# Altium schematic sheet PandMshem.SchDoc
size A; SheetNumber: 1; SheetTotal: 3
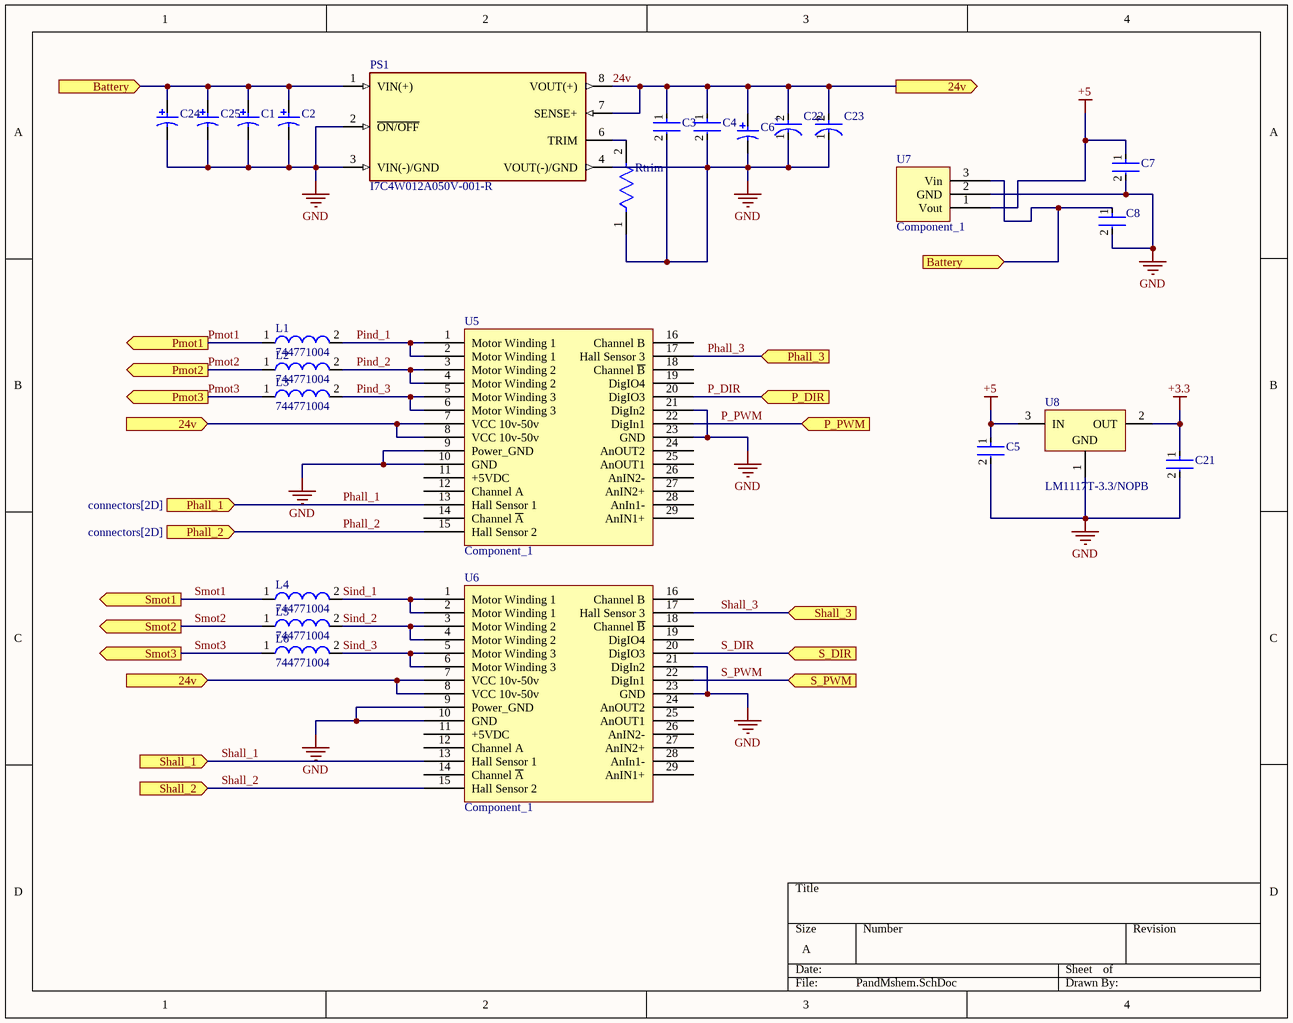
[diagram p0: PandMshem.SchDoc]

## Parts
C1  ECA1HM101  [CAPPR65-350-1150X800X1250]  (value not drawn)
C2  ECA1HM220  [CAPPR55-200-1100X500X1200]  (value not drawn)
C3  08055C105KAT2A  [FP-0805-L_2_01_0_2-W_1_25-MFG]  (value not drawn)
C4  C3225X7S1H106M250AB  [FP-C3225-250-0_4-IPC_C]  (value not drawn)
C5  C3225X7S1H106M250AB  [FP-C3225-250-0_4-IPC_C]  (value not drawn)
C6  ECA1HM101  [CAPPR65-350-1150X800X1250]  (value not drawn)
C7  GRM21BR61E226ME44L  [FP-GRM21B-0_2-e0_2_0_7-IPC_B]  (value not drawn)
C8  C3225X7S1H106M250AB  [FP-C3225-250-0_4-IPC_C]  (value not drawn)
C21  GRM21BR61E226ME44L  [FP-GRM21B-0_2-e0_2_0_7-IPC_B]  (value not drawn)
C22  EEUFM1V331B  [FP-RAD-TH-D_10_0_5-L_16_1-MFG]  (value not drawn)
C23  EEUFM1V331B  [FP-RAD-TH-D_10_0_5-L_16_1-MFG]  (value not drawn)
C24  ECA1HM101  [CAPPR65-350-1150X800X1250]  (value not drawn)
C25  ECA1HM101  [CAPPR65-350-1150X800X1250]  (value not drawn)
L1  744771004  [WE-PD-L]
L2  744771004  [WE-PD-L]
L3  744771004  [WE-PD-L]
L4  744771004  [WE-PD-L]
L5  744771004  [WE-PD-L]
L6  744771004  [WE-PD-L]
PS1  I7C4W012A050V-001-R  [CONV_I7C4W012A050V-001-R]
Rtrim  CRCW0805560KFKEA  [FP-CRCW0805-e3-IPC_A]  (value not drawn)
U5  Component_1  [Motor_Driver]
U6  Component_1  [Motor_Driver]
U7  Component_1  [5v_supply]
U8  LM1117T-3.3/NOPB  [NDE0003A]

## Ports
24v (in, see connectors[2B], connectors[2C], PandMshem[1B], PandMshem[3A]), 24v (in, see connectors[2B], connectors[2C], PandMshem[1C], PandMshem[3A]), 24v (out, see connectors[2B], connectors[2C], PandMshem[1B], PandMshem[1C]), Battery (in, see connectors[2B], connectors[3A], PandMshem[1A], Solenoid_drivers[1B], Solenoid_drivers[1C], Solenoid_drivers[1D], Solenoid_drivers[2A]), Battery (in, see connectors[2B], connectors[3A], PandMshem[3B], Solenoid_drivers[1B], Solenoid_drivers[1C], Solenoid_drivers[1D], Solenoid_drivers[2A]), P_DIR (in, see connectors[2A]), P_PWM (in, see connectors[2A]), Phall_1 (in, see connectors[2D]), Phall_2 (in, see connectors[2D]), Phall_3 (in, see connectors[2D]), Pmot1 (out, see connectors[4A]), Pmot2 (out, see connectors[4A]), Pmot3 (out, see connectors[3B]), S_DIR (in, see connectors[3A]), S_PWM (in, see connectors[3A]), Shall_1 (in, see connectors[3C]), Shall_2 (in, see connectors[3D]), Shall_3 (in, see connectors[3D]), Smot1 (out, see connectors[4B]), Smot2 (out, see connectors[3B]), Smot3 (out, see connectors[4C])

## Nets
+3.3: C21.1 U8.2(OUT)
+5: C5.1 C7.1 U7.1(Vout) U8.3(IN)
GND: C1.2 C2.2 C3.2 C4.2 C5.2 C6.2 C7.2 C8.2 C21.2 C22.1(C) C23.1(C) C24.2 C25.2 PS1.2(~{ON/OFF}) PS1.3(VIN(-)/GND) PS1.4(VOUT(-)/GND) Rtrim.1 U5.9(Power_GND) U5.10(GND) U5.21(DigIn2) U5.23(GND) U6.9(Power_GND) U6.10(GND) U6.21(DigIn2) U6.23(GND) U7.2(GND) U8.1(GND)
24v: C3.1 C4.1 C6.1 C22.2(A) C23.2(A) PS1.7(SENSE+) PS1.8(VOUT(+)) U5.7(VCC_10v-50v) U5.8(VCC_10v-50v) U6.7(VCC_10v-50v) U6.8(VCC_10v-50v) ; port 24v
Battery: C1.1 C2.1 C8.1 C24.1 C25.1 PS1.1(VIN(+)) U7.3(Vin) ; port Battery
P_DIR: U5.20(DigIO3) ; port P_DIR
P_PWM: U5.22(DigIn1) ; port P_PWM
Phall_1: U5.13(Hall_Sensor_1) ; port Phall_1
Phall_2: U5.15(Hall_Sensor_2) ; port Phall_2
Phall_3: U5.17(Hall_Sensor_3) ; port Phall_3
Pind_1: L1.2 U5.1(Motor_Winding_1) U5.2(Motor_Winding_1)
Pind_2: L2.2 U5.3(Motor_Winding_2) U5.4(Motor_Winding_2)
Pind_3: L3.2 U5.5(Motor_Winding_3) U5.6(Motor_Winding_3)
Pmot1: L1.1 ; port Pmot1
Pmot2: L2.1 ; port Pmot2
Pmot3: L3.1 ; port Pmot3
S_DIR: U6.20(DigIO3) ; port S_DIR
S_PWM: U6.22(DigIn1) ; port S_PWM
Shall_1: U6.13(Hall_Sensor_1) ; port Shall_1
Shall_2: U6.15(Hall_Sensor_2) ; port Shall_2
Shall_3: U6.17(Hall_Sensor_3) ; port Shall_3
Sind_1: L4.2 U6.1(Motor_Winding_1) U6.2(Motor_Winding_1)
Sind_2: L5.2 U6.3(Motor_Winding_2) U6.4(Motor_Winding_2)
Sind_3: L6.2 U6.5(Motor_Winding_3) U6.6(Motor_Winding_3)
Smot1: L4.1 ; port Smot1
Smot2: L5.1 ; port Smot2
Smot3: L6.1 ; port Smot3
NetPS1_6: PS1.6(TRIM) Rtrim.2

Not connected (* = marked no-connect by the designer): U5 11(+5VDC) 12(Channel_A) 14(Channel_~{A}) 16(Channel_B) 18(Channel_~{B}) 19(DigIO4) 24(AnOUT2) 25(AnOUT1) 26(AnIN2-) 27(AnIN2+) 28(AnIn1-) 29(AnIN1+); U6 11(+5VDC) 12(Channel_A) 14(Channel_~{A}) 16(Channel_B) 18(Channel_~{B}) 19(DigIO4) 24(AnOUT2) 25(AnOUT1) 26(AnIN2-) 27(AnIN2+) 28(AnIn1-) 29(AnIN1+)

## Notes on the sheet
- (in symbol CMP-05427-002072-1) +

## Library data of the parts
C1 C6 C24 C25 = CMP-1665-00042-2: Aluminum Electrolytic Capacitor, 100 uF, +/- 20%, 50 V, -40 to 85 degC, 2-Pin THD, RoHS, Bulk; Manufacturer: Panasonic; Lead Diameter: 0.6mm; Dielectric Material: Aluminium; Voltage Rating (DC): 50V; Ripple Current (AC): 250mA; Polarity: Polar; Leakage Current: 3uA; Capacitance: 100uF; Life (Hours): 2000Hour; Lead/Base Style: Straight; Dissipation Factor: 0.12%; Radiation Hardening: No; Height: 11.5mm; Package Quantity: 200; Package Reference: CAPPR65-350-1150X800X1250; Min Operating Temperature: -40degC; Mount: ThroughHole; Package Description: 2-Pin Radial Lead, Dia 8 mm, Height 12.5 mm; Case/Package: Radial; Diameter: 8mm; Voltage Rating: 50V; Length: 11.5mm; REACH SVHC: NoSVHC; Height - Seated (Max): 0.492inch; Datasheet URL: https://industrial.panasonic.com/cdbs/www-data/pdf/RDF0000/ABA0000C1218.pdf; RoHSCompliant: true; Ripple Current: 250mA; Lead Free: LeadFree; Voltage: 50V; Manufacturer URL: http://www.panasonic.com/; Number of Pins: 2; Datasheet Version: Rev. 05, 10/2016; Packaging: Bulk; Termination: Radial; Max Operating Temperature: 85degC; Tolerance: 20%; Lead Pitch: 3.5mm
C2 = CMP-1665-00036-2: Aluminum Electrolytic Capacitor, 22 uF, +/- 20%, 50 V, -40 to 85 degC, 2-Pin THD, RoHS, Bulk; Manufacturer: Panasonic; Ripple Current: 100mA; Life (Hours): 2000Hour; Voltage: 50V; Dissipation Factor: 0.12%; Leakage Current: 3uA; Lead/Base Style: Straight; Capacitance: 22uF; Lead Diameter: 0.5mm; Max Operating Temperature: 85degC; Height: 11mm; Package Reference: CAPPR55-200-1100X500X1200; Radiation Hardening: No; RoHSCompliant: true; Termination: Radial; Case/Package: Radial; REACH SVHC: NoSVHC; Height - Seated (Max): 0.472inch; Min Operating Temperature: -40degC; Packaging: Bulk; Manufacturer URL: http://www.panasonic.com/; Length: 11mm; Tolerance: 20%; Voltage Rating: 50V; Voltage Rating (DC): 50V; Datasheet URL: https://industrial.panasonic.com/cdbs/www-data/pdf/RDF0000/ABA0000C1218.pdf; Lead Pitch: 2mm; Ripple Current (AC): 100mA; Package Description: 2-Pin Radial Lead, Dia 5 mm, Height 12 mm; Diameter: 5mm; Datasheet Version: Rev. 05, 10/2016; Package Quantity: 200; Mount: ThroughHole
C3 = CMP-2007-04696-2: General Purpose Ceramic Capacitor, 0805, 1uF, 10%, X7R, 15%, 50V; Dissipation Factor: 2.5%; Packaging: Tape and Reel; Lead Free: Lead Free; Contact Plating: Tin; Dielectric: X7R; Tolerance: 10%; Capacitance: 1uF; REACH SVHC: No SVHC; Voltage Rating (DC): 50V; Depth: 1.25mm; Voltage Rating: 50V; Radiation Hardening: No; Case Code (Metric): 2012; Width: 0.049inch; Package Quantity: 1; Mount: Surface Mount; Length: 2.01mm; Series: -; Thickness: 0.037inch; Max Operating Temperature: 125°C; RoHS Compliant: Yes; Termination: SMD/SMT; Case/Package: 0805; Min Operating Temperature: -55°C; Voltage: 50V; Case Code (Imperial): 0805
C4 C5 C8 = CMP-08246-003772-1: Multilayer Ceramic Capacitors 10uF ±20% 50V X7S SMD 1210; Package Quantity: 1; Depth: 2.5mm; Dielectric: X7S; Radiation Hardening: No; Max Operating Temperature: 125°C; REACH SVHC: No SVHC; Thickness: 0.11inch; Voltage Rating: 50V; Length: 3.2mm; Case/Package: 1210; Min Operating Temperature: -55°C; Weight: 0.000564oz; Capacitance: 10uF; RoHS Compliant: Yes; Number of Pins: 2; Height: 2.5mm; Dielectric Material: Ceramic; Voltage: 50V; Lead Free: Lead Free; Case Code (Imperial): 1210; Packaging: Tape and Reel; Case Code (Metric): 3225; Mount: Surface Mount; Tolerance: 20%; Width: 0.098inch; Resistor Type: Ceramic; Termination: SMD/SMT; Voltage Rating (DC): 50V
C7 C21 = CMP-2007-03222-3: Chip Multilayer Ceramic Capacitors for General Purpose, 0805, 22uF, X5R, 15%, 20%, 25V; Case/Package: 0805; Depth: 1.25mm; Resistor Type: Ceramic; Voltage Rating: 25V; Lead Free: Lead Free; Voltage Rating (DC): 25V; Case Code (Metric): 2012; Thickness: 0.057inch; REACH SVHC: No SVHC; Material: Ceramic; Tolerance: 20%; Length: 2mm; Capacitance: 22uF; Case Code (Imperial): 0805; Max Operating Temperature: 85°C; Termination: SMD/SMT; Weight: 0.000335oz; Dielectric: X5R; Packaging: Tape and Reel; Voltage: 25V; Package Quantity: 3000; Height: 1.25mm; Mount: Surface Mount; Width: 1.25mm; Min Operating Temperature: -55°C
C22 C23 = CMP-05427-002072-1: Aluminum Electrolytic Capacitors (Radial Lead Type) 330uF ±20% 35V; ESR (Equivalent Series Resistance): 26mR; Life (Hours): 4000Hour; Ripple Current: 1.79A; Polarity: Polar; Lead Diameter: 0.6mm; Length: 16mm; Min Operating Temperature: -40°C; Package Quantity: 1000; Diameter: 10mm; Series: FM; RoHS Compliant: Yes; Lead Free: Lead Free; Tolerance: 20%; Voltage Rating (DC): 35V; Termination: Radial; Packaging: Tape and Reel; Contact Plating: Tin; Case/Package: Radial; Height: 16mm; Mount: Through Hole; Max Operating Temperature: 105°C; Impedance: 26mR; Capacitance: 330uF; Lead Pitch: 5mm; Radiation Hardening: No; Voltage Rating: 35V; Height - Seated (Max): 0.688inch
L1-L6 = CMP-0227-00698-1: SMD-Shielded Power Inductor WE-PD, L = 4.70 µH; Inductance: 4.70 ÂµH; ComponentLink1Description: Manufacturer Link; ComponentLink2Description: Datasheet; ComponentLink2URL: http://www.we-online.de/katalog/media/pdf/744771004.pdf; PackageReference: WE-PD-L; ComponentLink1URL: http://www.we-online.com; DatasheetVersion: ver 7, Sep-2006; PackageDescription: SMD Inductor, 2-Leads, Body 12.0 x 12.0 mm; PackageVersion: 2006
PS1 = I7C4W012A050V-001-R: Non-Isolated PoL Module DC DC Converter 1 Output 5 ~ 28V - - - 12.5A 9V - 53V Input; MF: TDK-Lambda Americas Inc; Value: *; Check_prices: https://www.snapeda.com/parts/I7C4W012A050V-001-R/TDK-Lambda+Americas+Inc/view-part/?ref=eda; MP: I7C4W012A050V-001-R; Price: None; Purchase-URL: https://pricing.snapeda.com/search/part/I7C4W012A050V-001-R/?ref=eda; Availability: In Stock; Package: Sixteenth Brick TDK-Lambda Americas Inc.; SnapEDA_Link: https://www.snapeda.com/parts/I7C4W012A050V-001-R/TDK-Lambda+Americas+Inc/view-part/?ref=snap
Rtrim = CMP-2001-04009-2: RES Thick Film, 560kΩ, 1%, 0.125W, 100ppm/°C, 0805; Max Power Dissipation: 125mW; Voltage Rating (DC): 150V; Resistance: 560kR; Temperature Coefficient: 100ppm/°C; Contact Plating: Tin; Case/Package: 0805; Power Rating: 125mW; Lead Free: Lead Free; Case Code (Metric): 2012; Case Code (Imperial): 0805; Termination: SMD/SMT; Width: 0.049inch; Features: Automotive AEC-Q200; Weight: 0.000194oz; Max Operating Temperature: 155°C; Number of Terminations: 2; Length: 2mm; Military Standard: Not; Package Quantity: 10; Tolerance: 1%; Radiation Hardening: No; Composition: Thick Film; Height: 0.45mm; Min Operating Temperature: -55°C; Packaging: Tape and Reel; Voltage Rating: 150V; Depth: 1.25mm
U8 = CMP-0062-02494-3: 800mA Low-Dropout Linear Regulator, 3-pin TO-220, Pb-Free; Manufacturer: Texas Instruments; PackageTopMarking: NSUZXYTTE#*LM1117T*3.3; PowerWise: N; CompType: LDO IC; RoHS: Y; ComponentLink1URL: http://www.ti.com/general/docs/lit/getliterature.tsp?genericPartNumber=LM1117-N&fileType=pdf; PackageReference: NDE0003A; PinCount: 3; ComponentLink1Description: Datasheet URL; PackageDescription: TO-220, Molded, 3 Lead, Straight